# Altium project Camera_LED_Module.PrjPcb
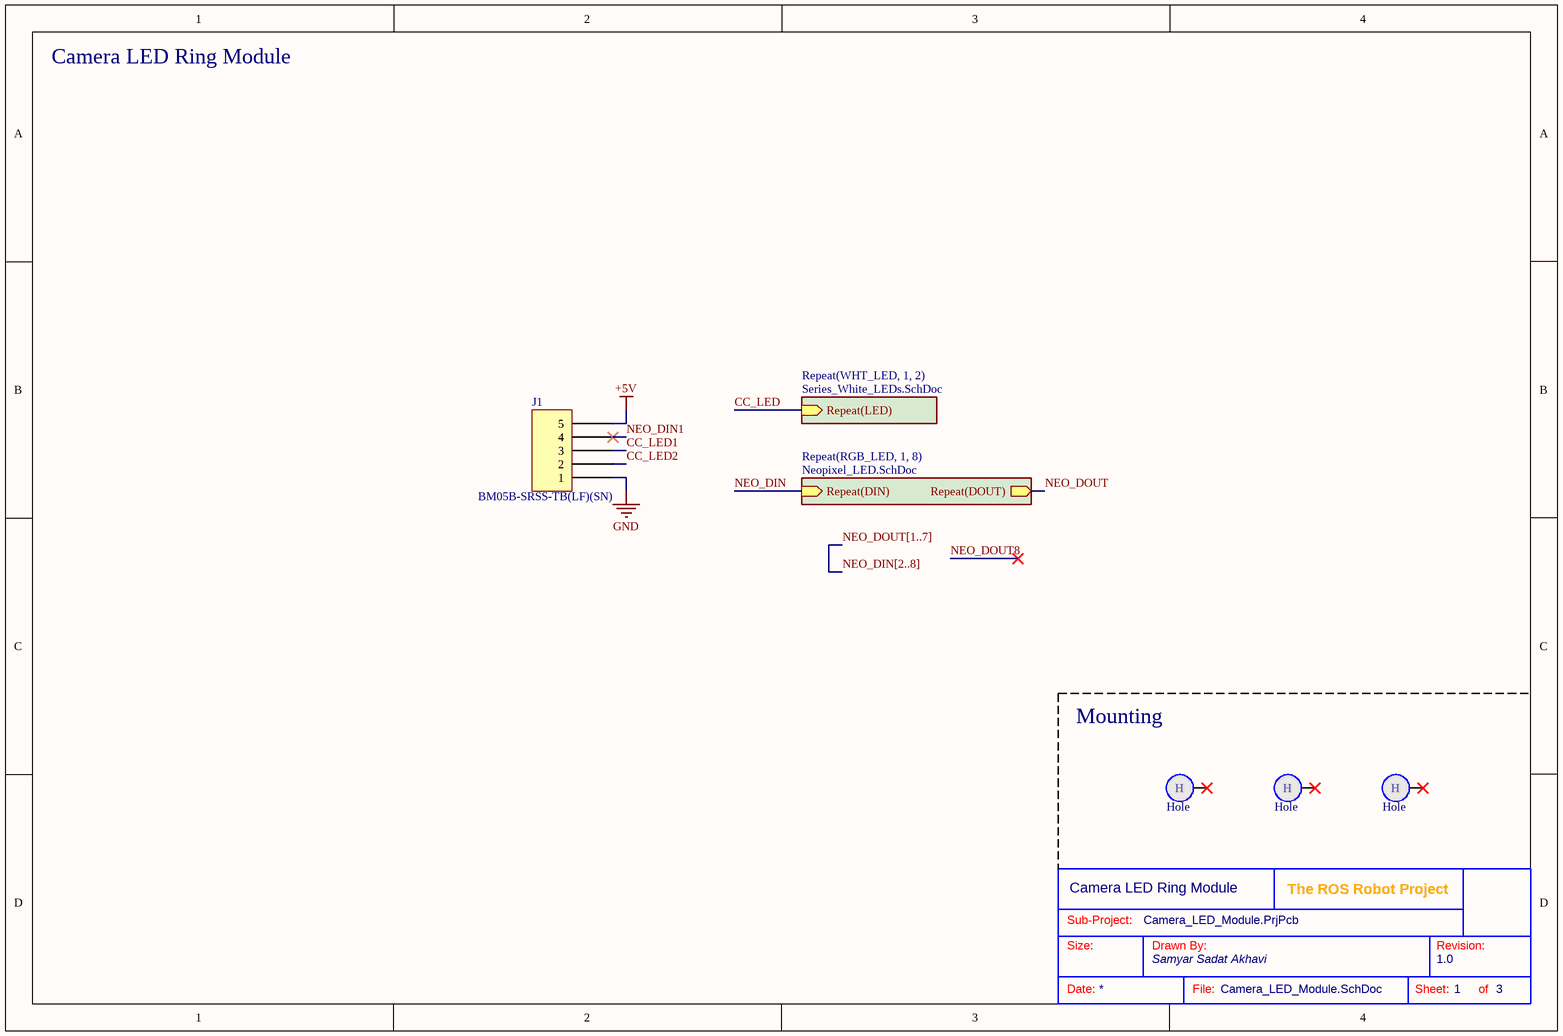
[diagram p0: Camera_LED_Module.SchDoc]
MainProjectName: The ROS Robot Project
2 sheets, 29 parts. Net scope: hierarchical (ports join the sheet entries above them; power ports are global).
Board file: Camera_LED_Module.PcbDoc
Sheets:
  Camera_LED_Module.SchDoc
    RGB_LED1 = Neopixel_LED.SchDoc
    RGB_LED2 = Neopixel_LED.SchDoc
    RGB_LED3 = Neopixel_LED.SchDoc
    RGB_LED4 = Neopixel_LED.SchDoc
    RGB_LED5 = Neopixel_LED.SchDoc
    RGB_LED6 = Neopixel_LED.SchDoc
    RGB_LED7 = Neopixel_LED.SchDoc
    RGB_LED8 = Neopixel_LED.SchDoc

## Sheet Camera_LED_Module.SchDoc: Camera LED Ring Module
size A4; DrawnBy: Samyar Sadat Akhavi; Revision: 1.0; SheetNumber: 1; SheetTotal: 3

### Parts
?  (no value)  (graphical)
Hole1  Hole  [Hole_2mm]  (no BOM)
Hole2  Hole  [Hole_2mm]  (no BOM)
Hole3  Hole  [Hole_2mm]  (no BOM)
J1  BM05B-SRSS-TB(LF)(SN)  [JST BM05B-SRSS-TB]

### Sub-sheets
Repeat(RGB_LED, 1, 8) = Neopixel_LED.SchDoc: Repeat(DIN) (in), Repeat(DOUT) (out)
Repeat(WHT_LED, 1, 2) = Series_White_LEDs.SchDoc (file not in this document): Repeat(LED) (in)

### Nets
+5V: J1.5
GND: J1.1
CC_LED: sheet Repeat(WHT_LED, 1, 2)/Repeat(LED)
CC_LED1: J1.3
CC_LED2: J1.2
NEO_DIN: sheet Repeat(RGB_LED, 1, 8)/Repeat(DIN)
NEO_DIN1: J1.4
NEO_DOUT: sheet Repeat(RGB_LED, 1, 8)/Repeat(DOUT)

Not connected (* = marked no-connect by the designer): Hole1 1*; Hole2 1*; Hole3 1*

### Buses and harness runs
bus NEO_DIN[2..8] = NEO_DOUT[1..7]

### Notes on the sheet
- Camera LED Ring Module
- Mounting
- Sub-Project:
- Size:
- Drawn By:
- Revision:
- Date:
- File:
- Sheet:
- of
- (in symbol Hole) H

### Library data of the parts
? = Standard Title Block
J1 = BM05B-SRSS-TB(LF)(SN): CONN HEADER SMD 5POS 1MM; Manufacturer: JST Sales America Inc.; Current Rating (Amps): 0.7A; Material Flammability Rating: UL94 V-0; Number of Positions: 5; Number of Positions Loaded: All; Pitch - Mating: 0.039" (1.00mm); Shrouding: Shrouded - 4 Wall; Style: Board to Cable/Wire; Voltage Rating: 50V; Part Number: BM05B-SRSS-TB(LF)(SN); ComponentLink1Description: Datasheet; ComponentLink1URL: http://www.jst-mfg.com/product/pdf/eng/eSR.pdf; ComponentLink2Description: DigiKey Link; ComponentLink2URL: http://digikey.com/product-detail/en/jst-sales-america-inc/BM05B-SRSS-TB-LF-SN/455-1791-1-ND/926862; Connector Type: Header; Contact Finish - Mating: Tin; Contact Finish - Post: Tin; Contact Material: Copper Alloy; Contact Shape: Square; Contact Type: Male Pin; Fastening Type: Push-Pull; Features: Solder Retention; Insulation Color: Natural; Insulation Height: 0.167" (4.25mm); Insulation Material: Polyamide (PA), Nylon; LastUpdated: 1/12/2020 10:14:00 PM; Lifecycle Status: Active; Minimum Order: 1; Mounting Type: Surface Mount; Number of Rows: 1; Operating Temperature: -25°C ~ 85°C; Packaging: TapeAndReel; PartId: 18; Part Status: Active; Price: 0.35; Series: SR; Supplier 1: DigiKey; Supplier Part Number 1: 455-1791-1-ND; Termination: Solder

## Sheet Neopixel_LED.SchDoc: RGB Illumination LED
size A4; DrawnBy: Samyar Sadat Akhavi; Revision: 1.0; SheetNumber: 3; SheetTotal: 3
Used 8 times, as channels RGB_LED1, RGB_LED2, RGB_LED3, RGB_LED4, RGB_LED5, RGB_LED6, RGB_LED7, RGB_LED8. Parts and nets are listed once, with the designators drawn on the sheet.
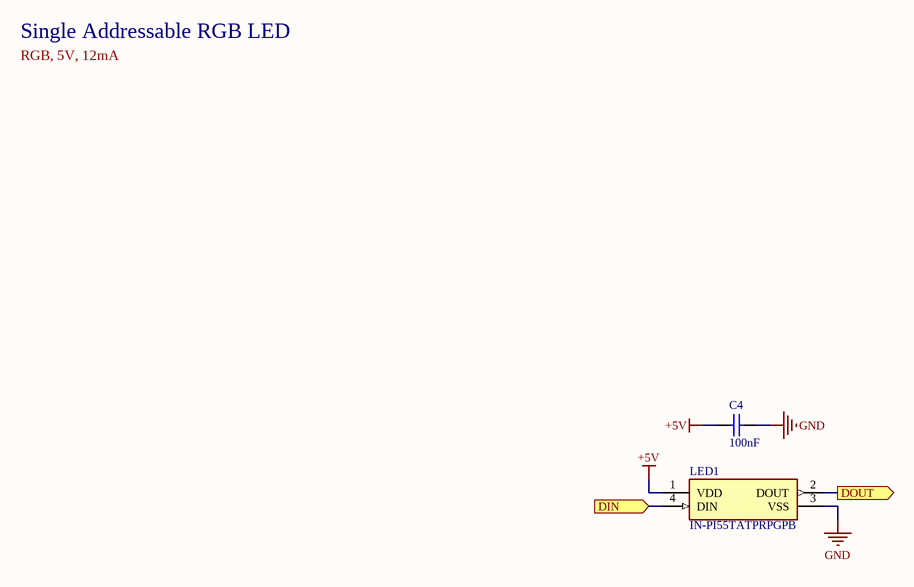
[diagram p1: Neopixel_LED.SchDoc]

### Parts
?  (no value)  (graphical)
C4  100nF  [CAP_SMD_603]
LED1  IN-PI55TATPRPGPB  [INPI55TATPRPGPB]

### Ports
DIN (in, see Camera_LED_Module[3B]), DOUT (out, see Camera_LED_Module[3B])

### Nets
+5V: C4.1 LED1.1(VDD)
GND: C4.2 LED1.3(VSS)
DIN: LED1.4(DIN) ; port DIN
DOUT: LED1.2(DOUT) ; port DOUT

### Channels
RGB_LED1: designators end in _RGB_LED1; ports DIN=NEO_DIN1 DOUT=NEO_DIN2
RGB_LED2: designators end in _RGB_LED2; ports DIN=NEO_DIN2 DOUT=NEO_DIN3
RGB_LED3: designators end in _RGB_LED3; ports DIN=NEO_DIN3 DOUT=NEO_DIN4
RGB_LED4: designators end in _RGB_LED4; ports DIN=NEO_DIN4 DOUT=NEO_DIN5
RGB_LED5: designators end in _RGB_LED5; ports DIN=NEO_DIN5 DOUT=NEO_DIN6
RGB_LED6: designators end in _RGB_LED6; ports DIN=NEO_DIN6 DOUT=NEO_DIN7
RGB_LED7: designators end in _RGB_LED7; ports DIN=NEO_DIN7 DOUT=NEO_DIN8
RGB_LED8: designators end in _RGB_LED8; ports DIN=NEO_DIN8 DOUT=NEO_DOUT8

### Notes on the sheet
- Single Addressable RGB LED
- RGB, 5V, 12mA
- Sub-Project:
- Size:
- Drawn By:
- Revision:
- Date:
- File:
- Sheet:
- of

### Library data of the parts
? = Standard Title Block
C4 = Non-polar Capacitor: Generic Ceramic Capacitor; Voltage: 16V; Value: 100nF
LED1 = IN-PI55TATPRPGPB: LED (Multiple); Manufacturer_Name: Inolux; Datasheet Link: https://www.futureelectronics.com/p/semiconductors--lighting-solutions--led-light-modules/in-pi55tatprpgpb-inolux-9107211; Height: 1.6mm; Manufacturer_Part_Number: IN-PI55TATPRPGPB; Mouser Part Number: 743-IN-PI55TATPRPGPB; Mouser Price/Stock: https://www.mouser.co.uk/ProductDetail/Inolux/IN-PI55TATPRPGPB?qs=mAH9sUMRCttUWI%2F2sR%2FcZg%3D%3D; Arrow Part Number: IN-PI55TATPRPGPB; Arrow Price/Stock: https://www.arrow.com/en/products/in-pi55tatprpgpb/inolux-corporation?region=nac

## Nets that join several sheets
+5V: Camera_LED_Module (J1.5), RGB_LED1 (C4_RGB_LED1.1 LED1_RGB_LED1.1), RGB_LED2 (C4_RGB_LED2.1 LED1_RGB_LED2.1), RGB_LED3 (C4_RGB_LED3.1 LED1_RGB_LED3.1), RGB_LED4 (C4_RGB_LED4.1 LED1_RGB_LED4.1), RGB_LED5 (C4_RGB_LED5.1 LED1_RGB_LED5.1), RGB_LED6 (C4_RGB_LED6.1 LED1_RGB_LED6.1), RGB_LED7 (C4_RGB_LED7.1 LED1_RGB_LED7.1), RGB_LED8 (C4_RGB_LED8.1 LED1_RGB_LED8.1)
GND: Camera_LED_Module (J1.1), RGB_LED1 (C4_RGB_LED1.2 LED1_RGB_LED1.3), RGB_LED2 (C4_RGB_LED2.2 LED1_RGB_LED2.3), RGB_LED3 (C4_RGB_LED3.2 LED1_RGB_LED3.3), RGB_LED4 (C4_RGB_LED4.2 LED1_RGB_LED4.3), RGB_LED5 (C4_RGB_LED5.2 LED1_RGB_LED5.3), RGB_LED6 (C4_RGB_LED6.2 LED1_RGB_LED6.3), RGB_LED7 (C4_RGB_LED7.2 LED1_RGB_LED7.3), RGB_LED8 (C4_RGB_LED8.2 LED1_RGB_LED8.3)
NEO_DIN1: Camera_LED_Module (J1.4), RGB_LED1 (LED1_RGB_LED1.4)
NEO_DIN2: RGB_LED1 (LED1_RGB_LED1.2), RGB_LED2 (LED1_RGB_LED2.4)
NEO_DIN3: RGB_LED2 (LED1_RGB_LED2.2), RGB_LED3 (LED1_RGB_LED3.4)
NEO_DIN4: RGB_LED3 (LED1_RGB_LED3.2), RGB_LED4 (LED1_RGB_LED4.4)
NEO_DIN5: RGB_LED4 (LED1_RGB_LED4.2), RGB_LED5 (LED1_RGB_LED5.4)
NEO_DIN6: RGB_LED5 (LED1_RGB_LED5.2), RGB_LED6 (LED1_RGB_LED6.4)
NEO_DIN7: RGB_LED6 (LED1_RGB_LED6.2), RGB_LED7 (LED1_RGB_LED7.4)
NEO_DIN8: RGB_LED7 (LED1_RGB_LED7.2), RGB_LED8 (LED1_RGB_LED8.4)